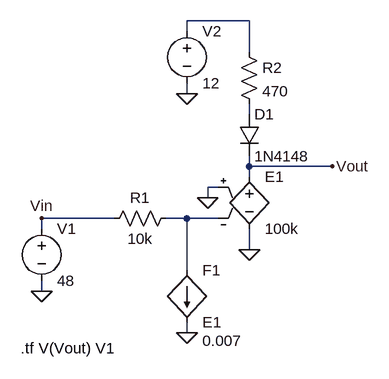
[diagram p0: schematic opto-amp-gain.asc]
opto-amp-gain.asc, the LTspice schematic file:
Version 4
SHEET 1 880 680
WIRE 160 -112 64 -112
WIRE 64 -96 64 -112
WIRE 160 -64 160 -112
WIRE 64 0 64 -16
WIRE 160 32 160 16
WIRE 160 112 160 96
WIRE 288 112 160 112
WIRE 160 128 160 112
WIRE 112 144 96 144
WIRE 96 160 96 144
WIRE -48 192 -160 192
WIRE 64 192 32 192
WIRE 112 192 64 192
WIRE -160 208 -160 192
WIRE 160 240 160 208
WIRE 64 272 64 192
WIRE -160 304 -160 288
WIRE 64 368 64 352
FLAG -160 304 0
FLAG 96 160 0
FLAG 160 240 0
FLAG 64 0 0
FLAG 64 368 0
FLAG 288 112 Vout
FLAG -160 192 Vin
SYMBOL e 160 112 R0
SYMATTR InstName E1
SYMATTR Value 100k
SYMBOL f 64 272 R0
WINDOW 123 24 108 Left 2
SYMATTR Value2 0.007
SYMATTR InstName F1
SYMATTR Value E1
SYMBOL res 48 176 R90
WINDOW 0 0 56 VBottom 2
WINDOW 3 32 56 VTop 2
SYMATTR InstName R1
SYMATTR Value 10k
SYMBOL voltage -160 192 R0
WINDOW 123 0 0 Left 2
WINDOW 39 0 0 Left 2
SYMATTR InstName V1
SYMATTR Value 48
SYMBOL diode 144 32 R0
SYMATTR InstName D1
SYMATTR Value 1N4148
SYMBOL res 144 -80 R0
SYMATTR InstName R2
SYMATTR Value 470
SYMBOL voltage 64 -112 R0
WINDOW 123 0 0 Left 2
WINDOW 39 0 0 Left 2
SYMATTR InstName V2
SYMATTR Value 12
TEXT -192 392 Left 2 !.tf V(Vout) V1

The netlist it stands for:
* opto-amp-gain.asc
E1 Vout 0 0 N003 100k
F1 N003 0 E1 0.007
R1 N003 Vin 10k
V1 Vin 0 48
D1 N002 Vout 1N4148
R2 N001 N002 470
V2 N001 0 12
.model D D
.lib standard.dio
.tf V(Vout) V1
.backanno
.end